# EAGLE design 8OR_1 (EAGLE 6.5.0)
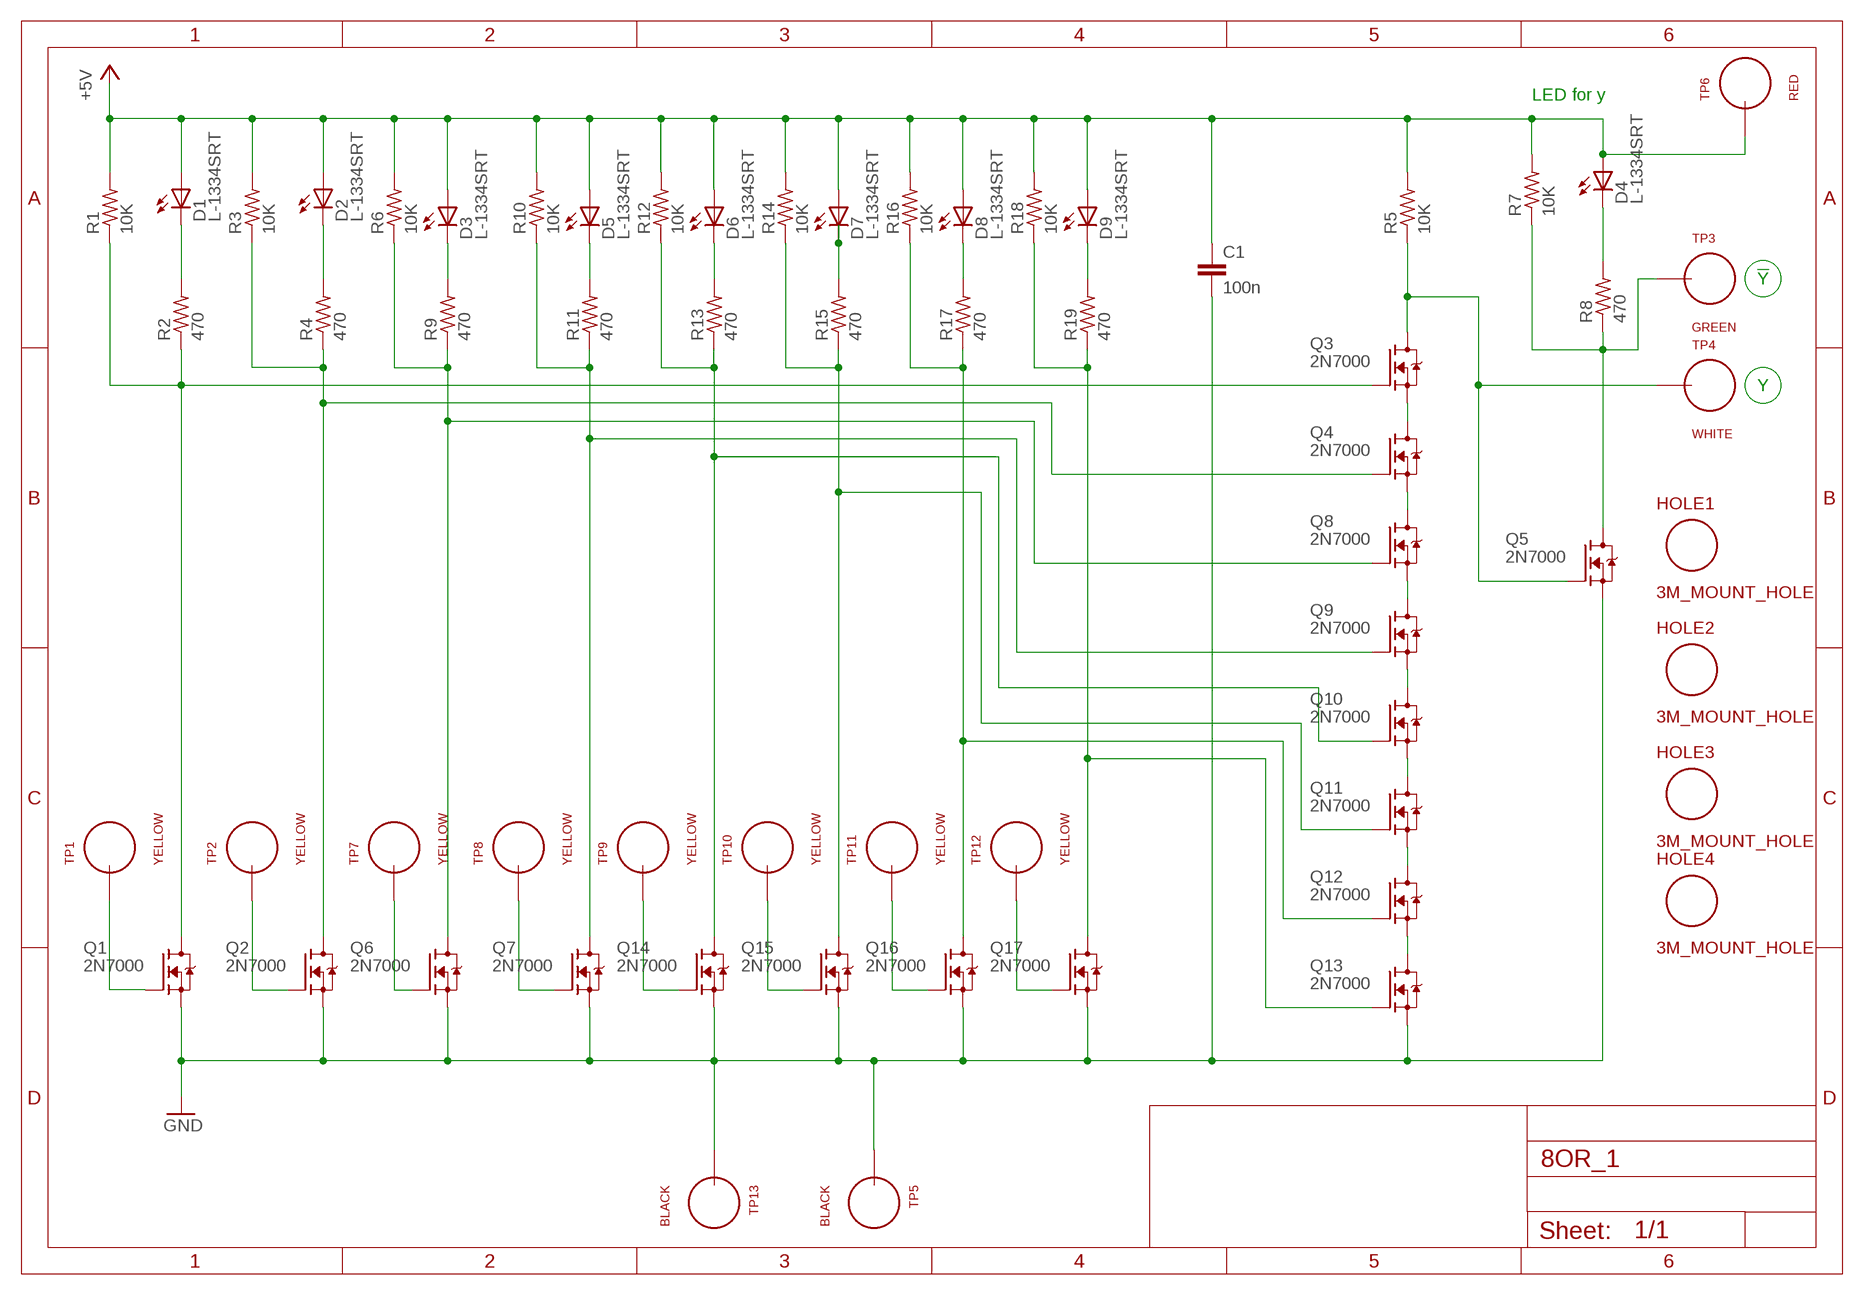
[diagram p0: schematic, sheet 1]

## Parts
C1  100n  C_P2INCH  [CAP_P2INCH]
D1  L-1334SRT  [LED3MM]
D2  L-1334SRT  [LED3MM]
D3  L-1334SRT  [LED3MM]
D4  L-1334SRT  [LED3MM]
D5  L-1334SRT  [LED3MM]
D6  L-1334SRT  [LED3MM]
D7  L-1334SRT  [LED3MM]
D8  L-1334SRT  [LED3MM]
D9  L-1334SRT  [LED3MM]
HOLE1  3M_MOUNT_HOLE  [3M_HOLE]
HOLE2  3M_MOUNT_HOLE  [3M_HOLE]
HOLE3  3M_MOUNT_HOLE  [3M_HOLE]
HOLE4  3M_MOUNT_HOLE  [3M_HOLE]
Q1  2N7000  [TO92-DGS]
Q2  2N7000  [TO92-DGS]
Q3  2N7000  [TO92-DGS]
Q4  2N7000  [TO92-DGS]
Q5  2N7000  [TO92-DGS]
Q6  2N7000  [TO92-DGS]
Q7  2N7000  [TO92-DGS]
Q8  2N7000  [TO92-DGS]
Q9  2N7000  [TO92-DGS]
Q10  2N7000  [TO92-DGS]
Q11  2N7000  [TO92-DGS]
Q12  2N7000  [TO92-DGS]
Q13  2N7000  [TO92-DGS]
Q14  2N7000  [TO92-DGS]
Q15  2N7000  [TO92-DGS]
Q16  2N7000  [TO92-DGS]
Q17  2N7000  [TO92-DGS]
R1  10K  R_P2INCH  [R_P2INCH]
R2  470  R_P2INCH  [R_P2INCH]
R3  10K  R_P2INCH  [R_P2INCH]
R4  470  R_P2INCH  [R_P2INCH]
R5  10K  R_P2INCH  [R_P2INCH]
R6  10K  R_P2INCH  [R_P2INCH]
R7  10K  R_P2INCH  [R_P2INCH]
R8  470  R_P2INCH  [R_P2INCH]
R9  470  R_P2INCH  [R_P2INCH]
R10  10K  R_P2INCH  [R_P2INCH]
R11  470  R_P2INCH  [R_P2INCH]
R12  10K  R_P2INCH  [R_P2INCH]
R13  470  R_P2INCH  [R_P2INCH]
R14  10K  R_P2INCH  [R_P2INCH]
R15  470  R_P2INCH  [R_P2INCH]
R16  10K  R_P2INCH  [R_P2INCH]
R17  470  R_P2INCH  [R_P2INCH]
R18  10K  R_P2INCH  [R_P2INCH]
R19  470  R_P2INCH  [R_P2INCH]
TP1  YELLOW  TEST_LOOP  [TEST_LOOP]
TP2  YELLOW  TEST_LOOP  [TEST_LOOP]
TP3  GREEN  TEST_LOOP  [TEST_LOOP]
TP4  WHITE  TEST_LOOP  [TEST_LOOP]
TP5  BLACK  TEST_LOOP  [TEST_LOOP]
TP6  RED  TEST_LOOP  [TEST_LOOP]
TP7  YELLOW  TEST_LOOP  [TEST_LOOP]
TP8  YELLOW  TEST_LOOP  [TEST_LOOP]
TP9  YELLOW  TEST_LOOP  [TEST_LOOP]
TP10  YELLOW  TEST_LOOP  [TEST_LOOP]
TP11  YELLOW  TEST_LOOP  [TEST_LOOP]
TP12  YELLOW  TEST_LOOP  [TEST_LOOP]
TP13  BLACK  TEST_LOOP  [TEST_LOOP]

## Nets
+5V: C1.1 D1.A D2.A D3.A D4.A D5.A D6.A D7.A D8.A D9.A R1.2 R3.2 R5.2 R6.2 R7.2 R10.2 R12.2 R14.2 R16.2 R18.2 TP6.P$1
GND: C1.2 Q1.S Q2.S Q5.S Q6.S Q7.S Q13.S Q14.S Q15.S Q16.S Q17.S TP5.P$1 TP13.P$1
N$1: Q3.D Q5.G R5.1 TP4.P$1
N$2: Q3.S Q4.D
N$3: D4.K(C) R8.2
N$4: Q5.D R7.1 R8.1 TP3.P$1
N$5: D5.K(C) R11.2
N$6: D2.K(C) R4.2
N$7: Q4.S Q8.D
N$8: D1.K(C) R2.2
N$9: Q1.D Q3.G R1.1 R2.1
N$10: D3.K(C) R9.2
N$11: Q1.G TP1.P$1
N$12: Q2.G TP2.P$1
N$13: Q6.D Q8.G R6.1 R9.1
N$14: Q9.S Q10.D
N$15: Q10.S Q11.D
N$16: Q7.D Q9.G R10.1 R11.1
N$17: Q2.D Q4.G R3.1 R4.1
N$18: Q8.S Q9.D
N$19: D6.K(C) R13.2
N$20: D7.K(C) R15.2
N$21: D8.K(C) R17.2
N$22: D9.K(C) R19.2
N$23: Q10.G Q14.D R12.1 R13.1
N$24: Q11.G Q15.D R14.1 R15.1
N$25: Q12.G Q16.D R16.1 R17.1
N$26: Q13.G Q17.D R18.1 R19.1
N$27: Q11.S Q12.D
N$28: Q12.S Q13.D
N$29: Q17.G TP12.P$1
N$30: Q16.G TP11.P$1
N$31: Q15.G TP10.P$1
N$32: Q14.G TP9.P$1
N$33: Q7.G TP8.P$1
N$34: Q6.G TP7.P$1

## Notes on the sheet
- LED for y
- !Y
- Y

## Library data of the parts
C1 = MyLib:C_P2INCH
D1-D9 = MyLib:L-1334SRT
HOLE1-HOLE4 = MyLib:3M_MOUNT_HOLE
Q1-Q17 = MyLib:2N7000
R1-R19 = MyLib:R_P2INCH
TP1-TP13 = MyLib:TEST_LOOP

## Board
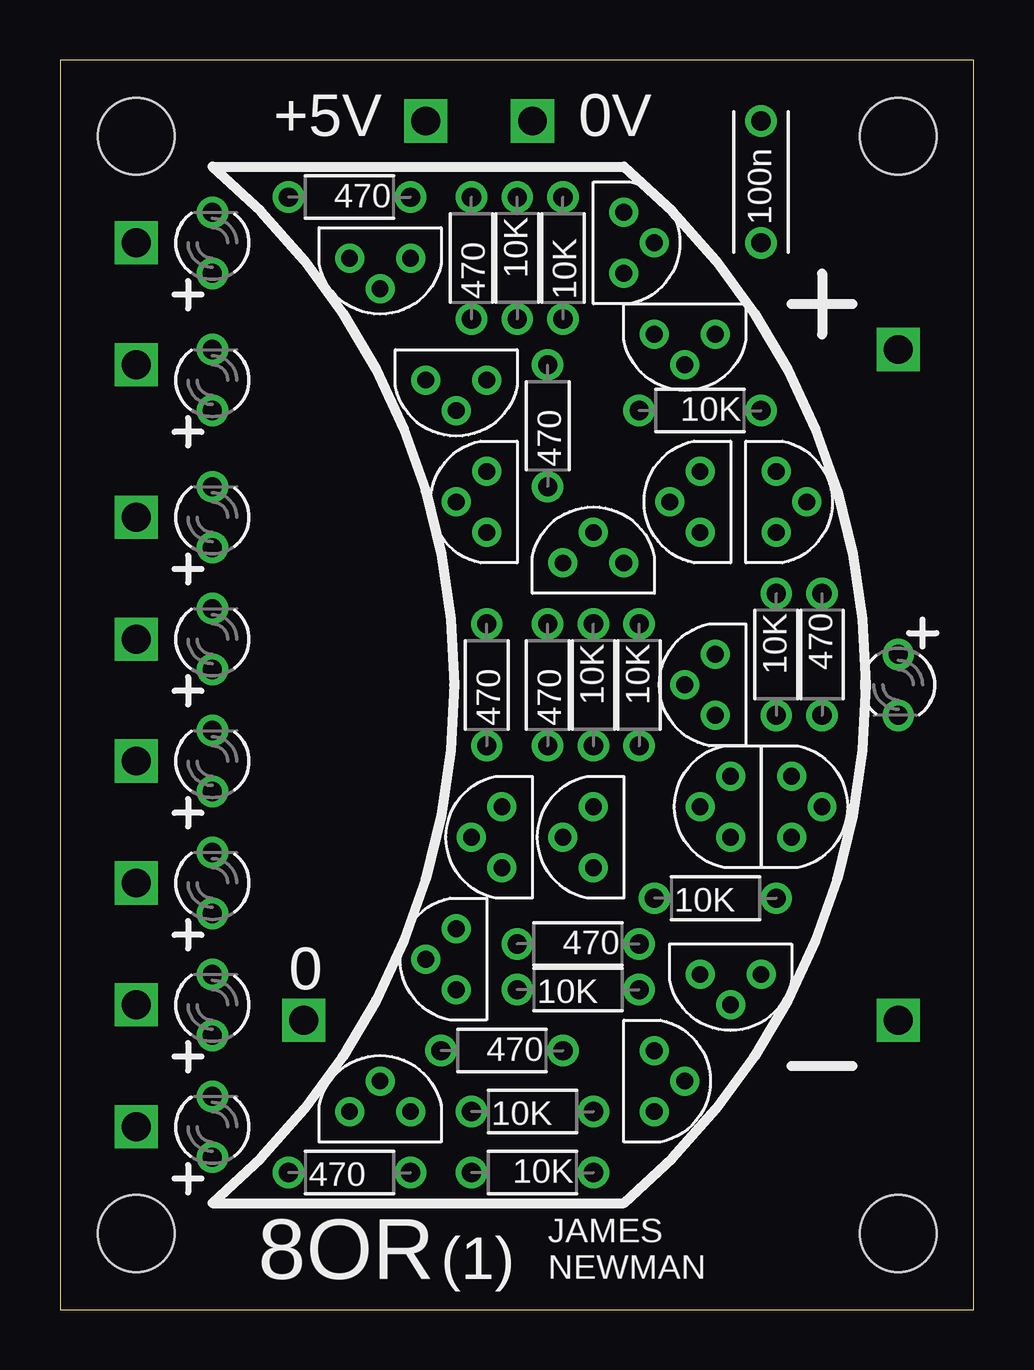
[diagram p1: board, top side]
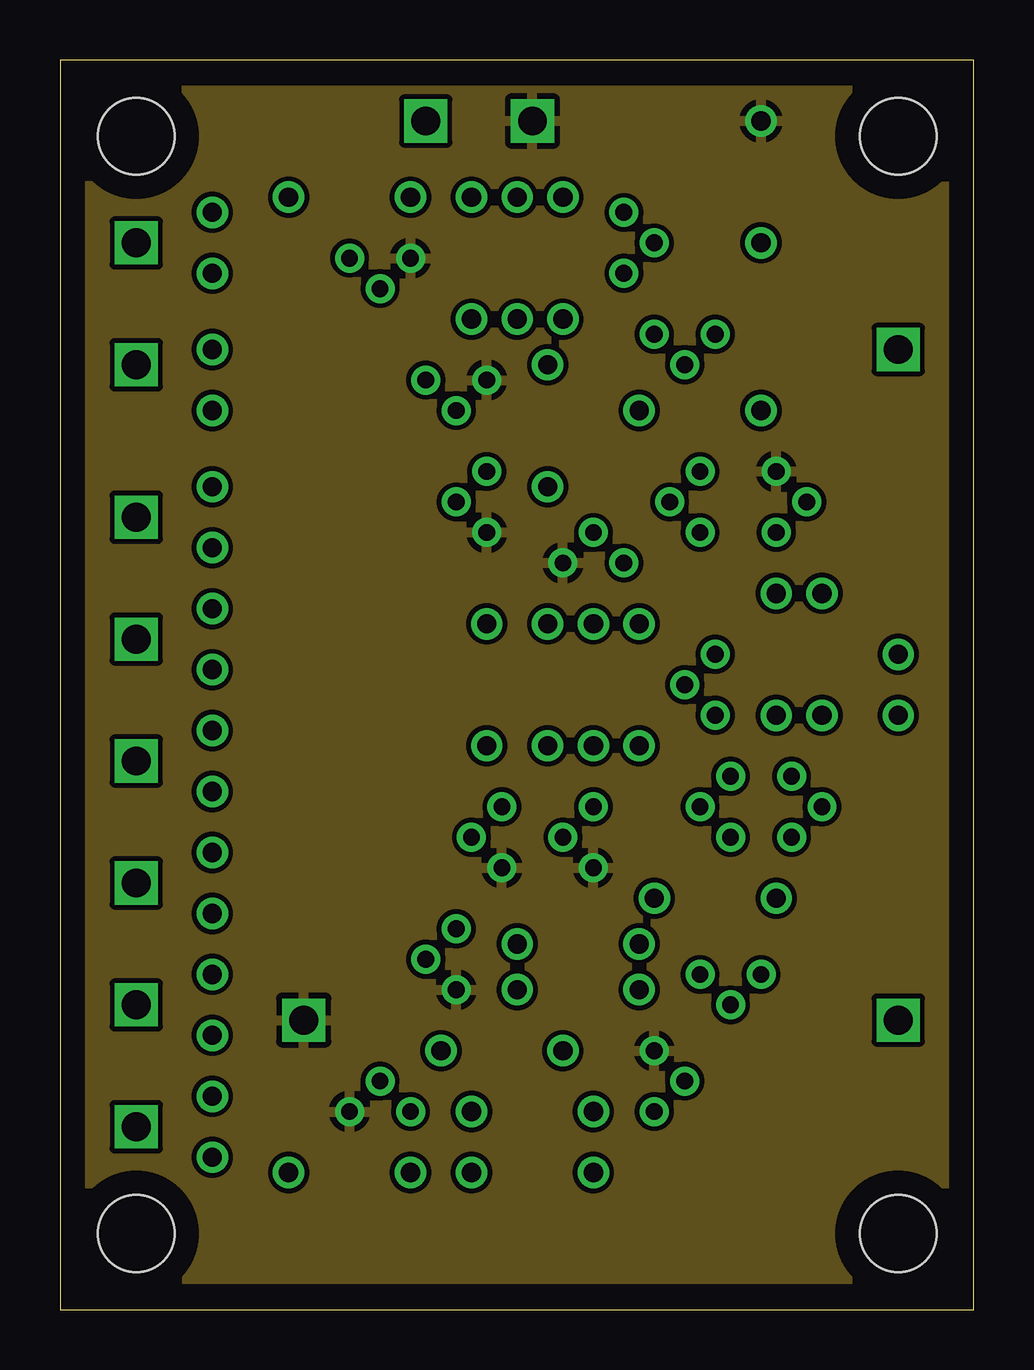
[diagram p2: board, inner layer Route2]
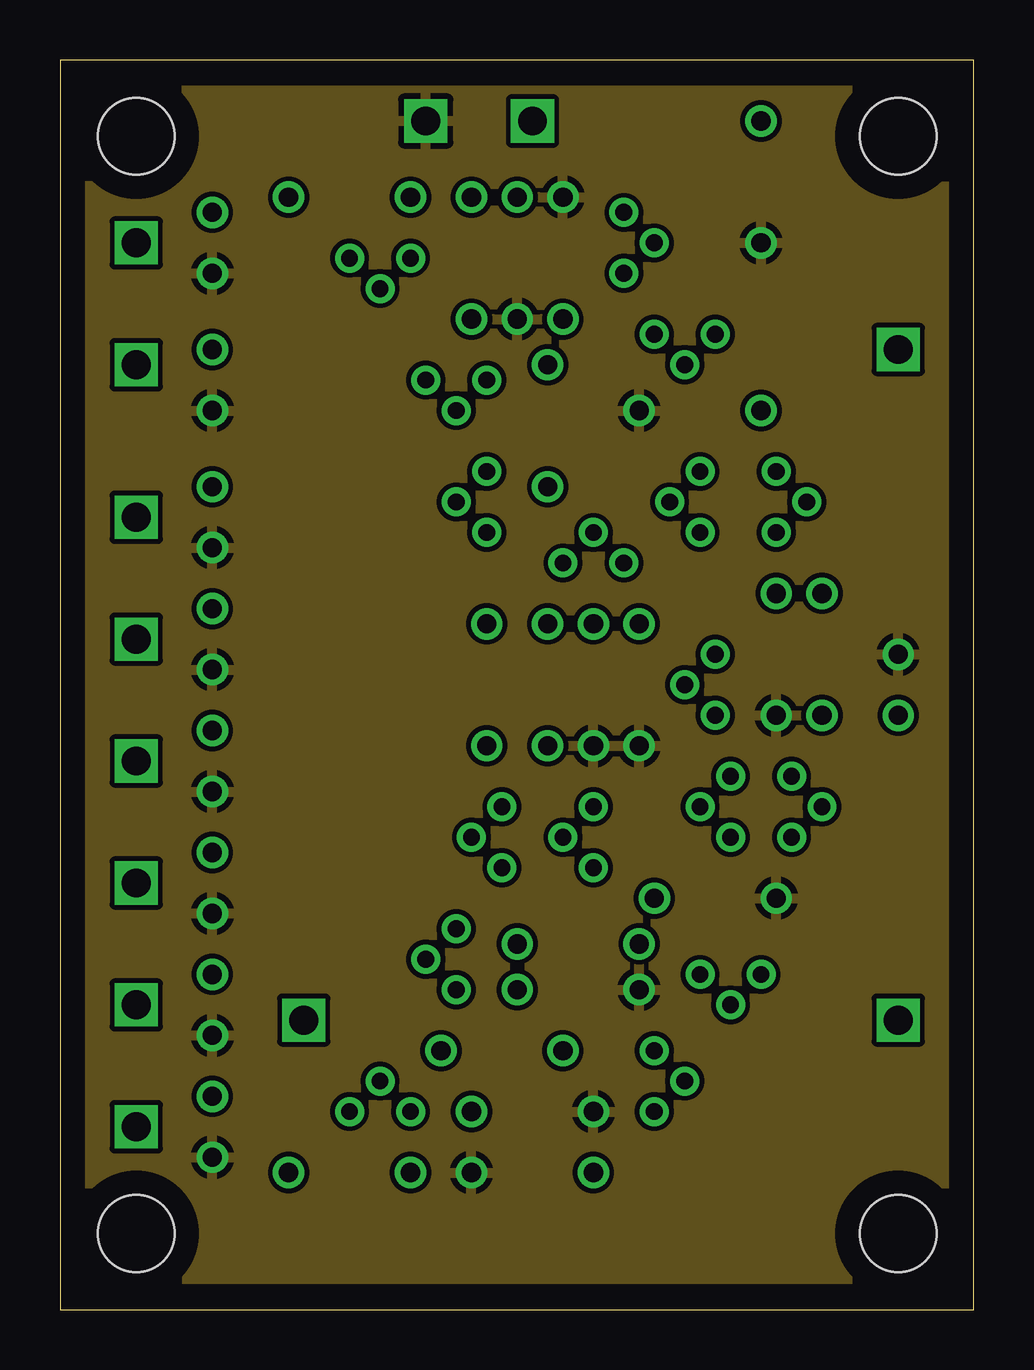
[diagram p3: board, inner layer Route3]
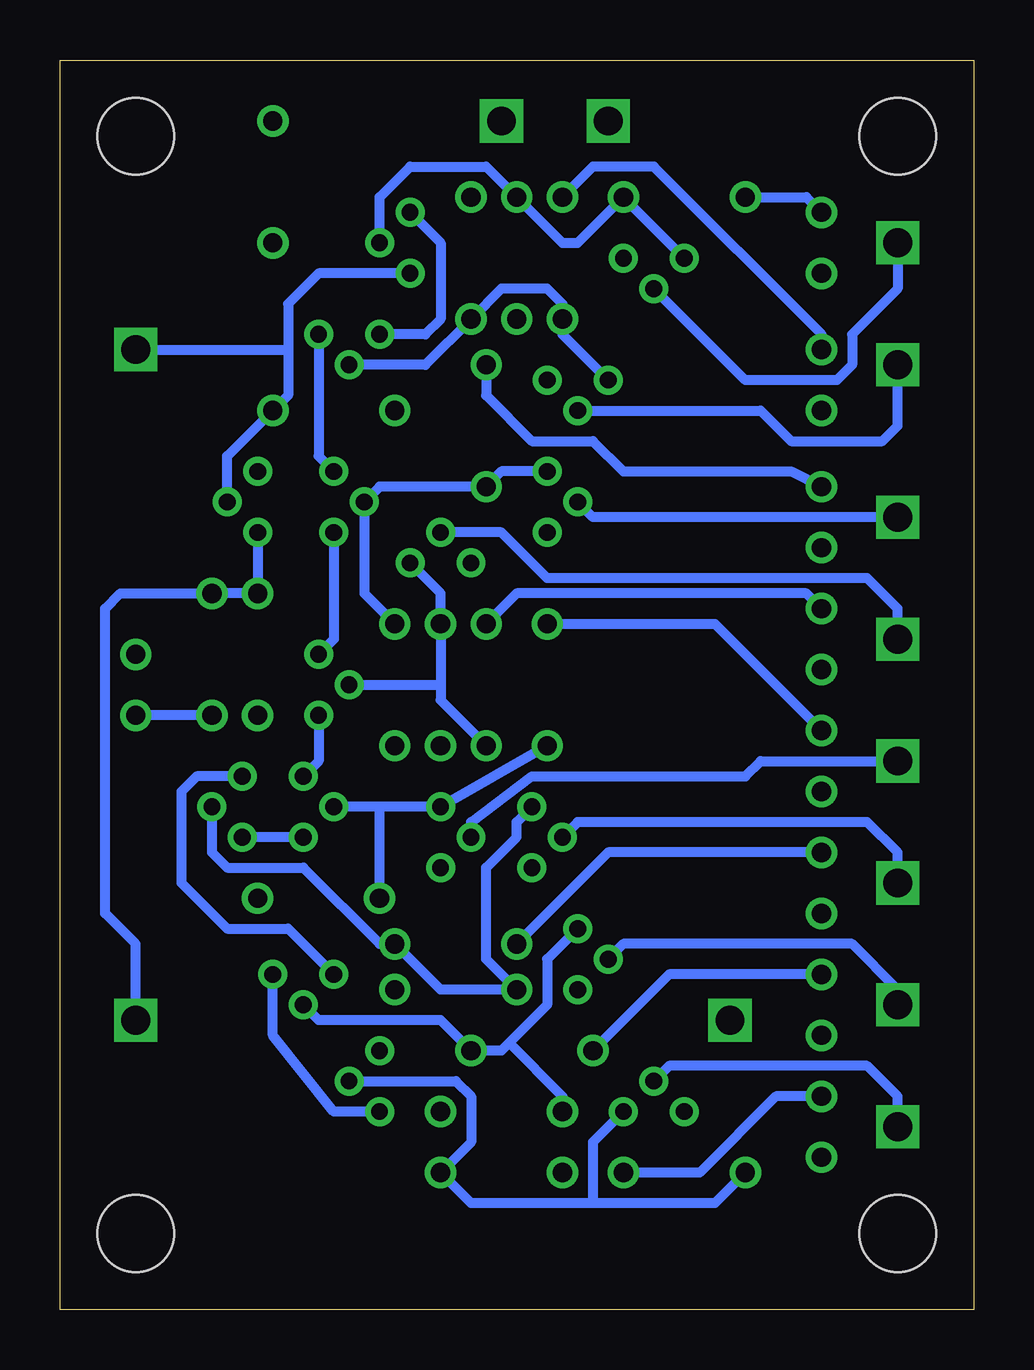
[diagram p4: board, bottom side, seen from below]

Size 38.08 x 52.07 mm. Coordinates in mm from the lower left corner, seen from the top.
Outline: 0,0 38.08,0 38.08,52.07 0,52.07 0,0
Copper layers (1*2+3*16): Top 0.035mm / dielectric 0.2mm / Route2 0.035mm / dielectric 1mm / Route3 0.035mm / dielectric 0.2mm / Bottom 0.035mm
Design rules "processor_rules_4layer": minimum track width 10mil, minimum drill 0.0236mm, track to track 8mil, track to pad 8mil, pad to pad 8mil, via to via 8mil, smd to smd 8mil, copper to edge 40mil, drill to drill 8mil, minimum pad ring 10mil, minimum via ring 8mil, stop-mask expansion 4mil, vias tented up to drill 0.7mm, thermal gap 10mil

### Footprints (pad centres in the part's own frame; a part is rotated, then mirrored left to right if it is on the bottom)
CAP_P2INCH = drill 0.8: 1 -2.54,0; 2 2.54,0
LED3MM = drill 0.8: A -1.27,0; K 1.27,0
3M_HOLE = hole 3.2: 0,0
TO92-DGS = drill 0.7: D 0,1.27; G -1.27,0; S 0,-1.27
R_P2INCH = drill 0.8: 1 -2.54,0; 2 2.54,0
TEST_LOOP = drill 1.2 square: P$1 0,0

### Placement (x,y rotation side)
C1  29.21,46.99 90 top
D1  6.35,44.45 90 top
D2  6.35,38.73 90 top
D3  6.35,33.02 90 top
D4  34.92,26.04 270 top
D5  6.35,27.94 90 top
D6  6.35,22.86 90 top
D7  6.35,17.78 90 top
D8  6.35,12.7 90 top
D9  6.35,7.62 90 top
HOLE1  3.17,3.17 0 top
HOLE2  3.17,48.9 0 top
HOLE3  34.92,3.17 0 top
HOLE4  34.92,48.9 0 top
Q1  13.34,43.81 90 top
Q2  16.51,38.73 90 top
Q3  23.5,44.45 180 top
Q4  26.04,40.64 90 top
Q5  29.84,33.66 180 top
Q6  17.78,33.66 0 top
Q7  22.23,31.11 270 top
Q8  26.67,33.66 0 top
Q9  27.3,26.04 0 top
Q10  27.94,20.95 0 top
Q11  30.48,20.95 180 top
Q12  27.94,13.97 90 top
Q13  24.77,9.53 180 top
Q14  22.23,19.68 0 top
Q15  18.41,19.68 0 top
Q16  16.51,14.61 0 top
Q17  13.34,8.26 270 top
R1  19.05,43.81 270 top
R2  12.06,46.35 180 top
R3  20.95,43.81 90 top
R4  17.14,43.81 90 top
R5  26.67,37.47 180 top
R6  24.13,26.04 270 top
R7  29.84,27.3 270 top
R8  31.75,27.3 270 top
R9  20.32,36.83 90 top
R10  22.23,26.04 270 top
R11  20.32,26.04 90 top
R12  27.3,17.14 0 top
R13  17.78,26.04 90 top
R14  21.59,13.34 0 top
R15  21.59,15.24 180 top
R16  19.68,8.26 0 top
R17  18.41,10.79 180 top
R18  19.68,5.71 180 top
R19  12.06,5.71 0 top
TP1  3.17,44.45 0 top
TP2  3.17,39.37 0 top
TP3  34.92,12.06 0 top
TP4  34.92,40.01 0 top
TP5  19.68,49.53 0 top
TP6  15.24,49.53 0 top
TP7  3.17,33.02 0 top
TP8  3.17,27.94 0 top
TP9  3.17,22.86 0 top
TP10  3.17,17.78 0 top
TP11  3.17,12.7 0 top
TP12  3.17,7.62 0 top
TP13  10.16,12.06 0 top

### Tracks (layer width: path | path; a pad name or v marks a point on that pad's centre or on a via)
+5V
  pour Route3: 1.27,50.8 36.83,50.8 36.83,1.27 1.27,1.27
GND
  pour Route2: 1.27,50.8 36.83,50.8 36.83,1.27 1.27,1.27
N$1
  Bottom 0.406: Q3.D 27.3,43.18 28.57,41.91 28.57,40.01 | 28.57,40.01 28.57,38.1 R5.1 31.11,35.56 Q5.G | TP4.P$1 28.57,40.01
N$2
  Bottom 0.406: Q3.S 22.23,44.45 22.23,41.27 22.86,40.64 Q4.D
N$3
  Bottom 0.406: R8.2 D4.K
N$4
  Bottom 0.406: Q5.D R7.1 R8.1 35.56,29.84 36.2,29.21 36.2,16.51 34.92,15.24 TP3.P$1
N$5
  Bottom 0.406: D5.K 6.99,29.84 19.05,29.84 R11.2
N$6
  Bottom 0.406: D2.K 6.35,40.64 13.34,47.62 15.88,47.62 R4.2
N$7
  Bottom 0.406: Q4.S 27.3,35.56 Q8.D
N$8
  Bottom 0.406: R2.2 6.99,46.35 D1.K
N$9
  Bottom 0.406: Q3.G 24.77,46.35 23.5,47.62 20.32,47.62 R1.1 17.14,44.45 16.51,44.45 R2.1 Q1.D
N$10
  Bottom 0.406: R9.2 20.32,38.1 18.41,36.2 15.88,36.2 14.61,34.92 7.62,34.92 D3.K
N$11
  Bottom 0.406: TP1.P$1 3.17,42.55 5.08,40.64 5.08,39.37 5.71,38.73 9.53,38.73 Q1.G
N$12
  Bottom 0.406: Q2.G 8.89,37.47 7.62,36.2 3.81,36.2 3.17,36.83 TP2.P$1
N$13
  Bottom 0.406: Q6.D 19.68,34.92 R9.1 24.77,34.29 Q8.G 25.4,29.84 R6.1
N$14
  Bottom 0.406: Q9.S 27.3,22.86 Q10.D
N$15
  Bottom 0.406: Q10.S Q11.D
N$16
  Bottom 0.406: 22.23,26.04 R10.1 22.23,29.84 Q7.D | 22.23,26.04 22.23,25.4 R11.1 | Q9.G 22.23,26.04
N$17
  Bottom 0.406: Q2.D 17.14,40.64 R4.1 17.14,41.91 17.78,42.55 19.68,42.55 R3.1 22.86,39.37 Q4.G
N$18
  Bottom 0.406: Q8.S 26.67,27.94 Q9.D
N$19
  Bottom 0.406: R13.2 10.79,28.57 D6.K
N$20
  Bottom 0.406: D7.K 15.24,19.05 R15.2
N$21
  Bottom 0.406: D8.K 12.7,13.97 R17.2
N$22
  Bottom 0.406: D9.K 8.26,8.89 11.43,5.71 R19.2
N$23
  Bottom 0.406: 24.77,20.95 Q14.D R13.1 | 24.77,20.95 Q10.G | R12.1 24.77,20.95
N$24
  Bottom 0.406: Q11.G 31.75,19.05 31.11,18.41 27.94,18.41 24.77,15.24 R15.1 22.23,13.34 R14.1 20.32,14.61 20.32,18.41 19.05,19.68 19.05,20.32 Q15.D
N$25
  Bottom 0.406: Q12.G 27.3,12.06 22.23,12.06 R17.1 19.68,10.79 19.37,11.11 | Q16.D 17.78,14.61 17.78,12.7 19.37,11.11 | R16.1 17.14,8.89 19.37,11.11
N$26
  Bottom 0.406: R19.1 10.79,4.45 15.88,4.45 | 15.88,4.45 20.95,4.45 R18.1 20.95,6.99 20.95,8.89 21.59,9.53 Q13.G | Q17.D 15.88,6.99 15.88,4.45
N$27
  Bottom 0.406: Q11.S 32.38,22.23 33.02,21.59 33.02,17.78 31.11,15.88 28.57,15.88 Q12.D
N$28
  Bottom 0.406: Q13.D 26.67,8.26 29.21,11.43 Q12.S
N$29
  Bottom 0.406: TP12.P$1 3.17,8.89 4.45,10.16 12.7,10.16 Q17.G
N$30
  Bottom 0.406: TP11.P$1 3.17,13.34 5.08,15.24 14.61,15.24 Q16.G
N$31
  Bottom 0.406: TP10.P$1 3.17,19.05 4.45,20.32 16.51,20.32 Q15.G
N$32
  Bottom 0.406: Q14.G 20.95,20.32 18.41,22.23 9.53,22.23 8.89,22.86 TP9.P$1
N$33
  Bottom 0.406: TP8.P$1 3.17,29.21 4.45,30.48 17.78,30.48 19.68,32.38 Q7.G
N$34
  Bottom 0.406: TP7.P$1 15.88,33.02 Q6.G

### Text on the board
tPlace: +5V | 0V | 0 | 8OR | (1) | JAMES / NEWMAN